# Altium project Smart_Assistant_H3.PrjPcb
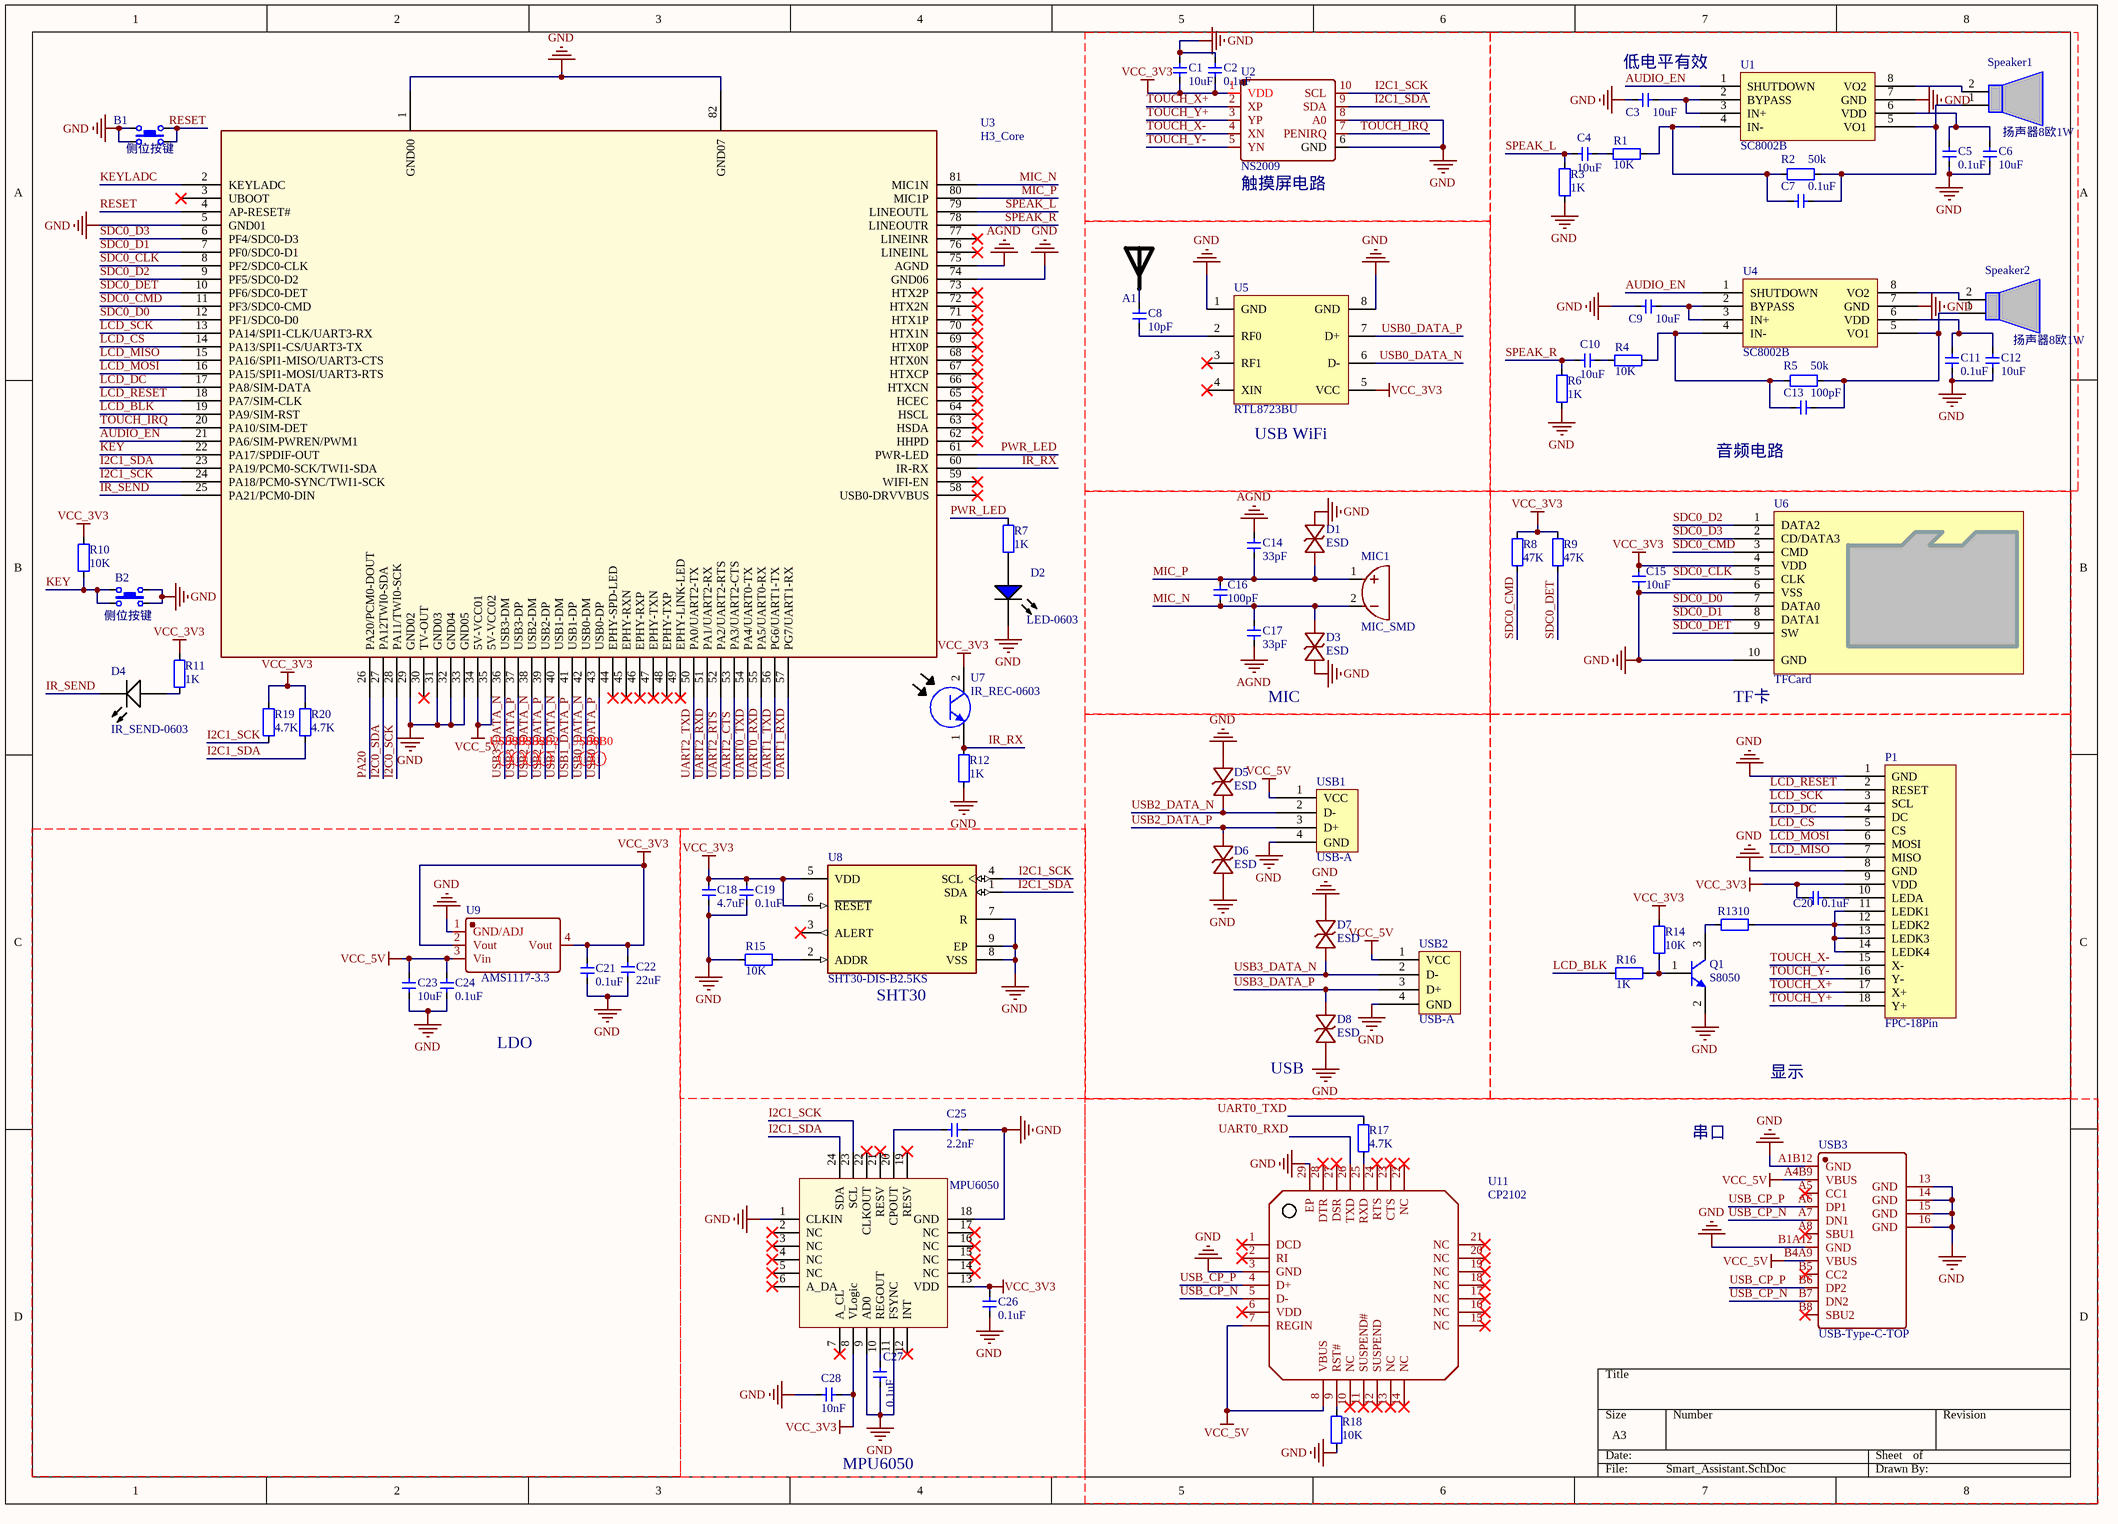
[diagram p0: Smart_Assistant.SchDoc]
1 sheet, 78 parts. Net scope: global (net labels, ports and power ports of the same name join across sheets).
Board file: Smart_Assistant.PcbDoc

## Sheet Smart_Assistant.SchDoc
size A3; SheetNumber: 1; SheetTotal: 1

### Parts
A1  RAINSUN  [ANT-Rainsun-AN5120]  (value not drawn)
B1  侧位按键  [侧位按键_3.5*3.55_90]
B2  侧位按键  [侧位按键_3.5*3.55_90]
C1  10uF  [电容0603]
C2  0.1uF  [电容0603]
C3  10uF  [电容0603]
C4  10uF  [电容0603]
C5  0.1uF  [电容0603]
C6  10uF  [电容0603]
C7  0.1uF  [电容0603]
C8  10pF  [电容0603]
C9  10uF  [电容0603]
C10  10uF  [电容0603]
C11  0.1uF  [电容0603]
C12  10uF  [电容0603]
C13  100pF  [电容0603]
C14  33pF  [电容0603]
C15  10uF  [电容0603]
C16  100pF  [电容0603]
C17  33pF  [电容0603]
C18  4.7uF  [电容0603]
C19  0.1uF  [电容0603]
C20  0.1uF  [电容0603]
C21  0.1uF  [电容0603]
C22  22uF  [电容0603]
C23  10uF  [电容0603]
C24  0.1uF  [电容0603]
C25  2.2nF  [电容0603]
C26  0.1uF  [电容0603]
C27  0.1uF  [电容0603]
C28  10nF  [电容0603]
D1  ESD  [ESD-0603]
D2  LED-0603  [LED-0603]
D3  ESD  [ESD-0603]
D4  IR_SEND-0603  [IR_SEND-0603]
D5  ESD  [ESD-0603]
D6  ESD  [ESD-0603]
D7  ESD  [ESD-0603]
D8  ESD  [ESD-0603]
MIC1  MIC_SMD  [MIC_SMD]
P1  FPC-18Pin  [FPC-0.5mm-18Pin]
Q1  S8050  [NPN-SOT-23]
R1  10K  [电阻0603]
R2  50k  [电阻0603]
R3  1K  [电阻0603]
R4  10K  [电阻0603]
R5  50k  [电阻0603]
R6  1K  [电阻0603]
R7  1K  [电阻0603]
R8  47K  [电阻0603]
R9  47K  [电阻0603]
R10  10K  [电阻0603]
R11  1K  [电阻0603]
R12  1K  [电阻0603]
R13  10  [电阻0603]
R14  10K  [电阻0603]
R15  10K  [电阻0603]
R16  1K  [电阻0603]
R17  4.7K  [电阻0603]
R18  10K  [电阻0603]
R19  4.7K  [电阻0603]
R20  4.7K  [电阻0603]
Speaker1  扬声器8欧1W  [扬声器 8欧1W]
Speaker2  扬声器8欧1W  [扬声器 8欧1W]
U1  SC8002B  [SC8002B-SOP-8]
U2  NS2009  [NS2009]
U3  H3_Core  [H3_Core]
U4  SC8002B  [SC8002B-SOP-8]
U5  RTL8723BU  [UBS_WiFi]
U6  TFCard  [TFCard]
U7  IR_REC-0603  [IR_REC-0603]
U8  SHT30-DIS-B2.5KS  [FP-SHT30-DIS-B2_5KS-MFG]
U9  AMS1117-3.3  [AMS1117-3.3]
U10  MPU6050  [QFN24-4*4]
U11  CP2102  [CP2102]
USB1  USB-A  [USB-A-TOP]
USB2  USB-A  [USB-A-TOP]
USB3  USB-Type-C-TOP  [Type-C-TOP]

### Nets
AGND: C14.2 C17.1 U3.75(AGND)
GND: B1.1 B1.3 B2.2 B2.4 C1.2 C2.2 C3.1 C5.1 C6.1 C9.1 C11.1 C12.1 C15.1 C18.1 C19.1 C21.1 C22.1 C23.1 C24.1 C25.2 C26.1 C27.1 C28.1 D1.2 D2.2(K) D3.1 D5.2 D6.1 D7.2 D8.1 P1.1(GND) P1.8(GND) Q1.2(E) R3.1 R6.1 R12.2 R15.1 R18.1 U1.7(GND) U2.6(GND) U2.8(A0) U3.1(GND00) U3.5(GND01) U3.29(GND02) U3.31(GND03) U3.32(GND04) U3.33(GND05) U3.74(GND06) U3.82(GND07) U4.7(GND) U5.1(GND) U5.8(GND) U6.6(VSS) U6.10(GND) U8.7(R) U8.8(VSS) U8.9(EP) U9.1(GND/ADJ) U10.1(CLKIN) U10.9(AD0) U10.11(FSYNC) U10.18(GND) U11.3(GND) U11.29(EP) USB1.4(GND) USB2.4(GND) USB3.13(GND) USB3.14(GND) USB3.15(GND) USB3.16(GND) USB3.A1B12(GND) USB3.B1A12(GND)
VCC_3V3: C1.1 C2.1 C15.2 C18.2 C19.2 C20.1 C21.2 C22.2 C26.2 C28.2 P1.9(VDD) R8.1 R9.1 R10.2 R11.2 R14.2 R19.2 R20.2 U2.1(VDD) U5.5(VCC) U6.4(VDD) U7.2(C) U8.5(VDD) U8.6(~{RESET}) U9.2(Vout) U9.4(Vout) U10.8(VLogic) U10.13(VDD)
VCC_5V: C23.2 C24.2 U3.34(5V-VCC01) U3.35(5V-VCC02) U9.3(Vin) U11.7(REGIN) U11.8(VBUS) USB1.1(VCC) USB2.1(VCC) USB3.A4B9(VBUS) USB3.B4A9(VBUS)
AUDIO_EN: U1.1(SHUTDOWN) U3.21(PA6/SIM-PWREN/PWM1) U4.1(SHUTDOWN)
I2C0_SCK: U3.28(PA11/TWI0-SCK)
I2C0_SDA: U3.27(PA12TWI0-SDA)
I2C1_SCK: R19.1 U2.10(SCL) U3.24(PA18/PCM0-SYNC/TWI1-SCK) U8.4(SCL) U10.23(SCL)
I2C1_SDA: R20.1 U2.9(SDA) U3.23(PA19/PCM0-SCK/TWI1-SDA) U8.1(SDA) U10.24(SDA)
IR_RX: R12.1 U3.60(IR-RX) U7.1(E)
IR_SEND: D4.2(K) U3.25(PA21/PCM0-DIN)
KEY: B2.1 B2.3 R10.1 U3.22(PA17/SPDIF-OUT)
KEYLADC: U3.2(KEYLADC)
LCD_BLK: R16.1 U3.19(PA9/SIM-RST)
LCD_CS: P1.5(CS) U3.14(PA13/SPI1-CS/UART3-TX)
LCD_DC: P1.4(DC) U3.17(PA8/SIM-DATA)
LCD_MISO: P1.7(MISO) U3.15(PA16/SPI1-MISO/UART3-CTS)
LCD_MOSI: P1.6(MOSI) U3.16(PA15/SPI1-MOSI/UART3-RTS)
LCD_RESET: P1.2(RESET) U3.18(PA7/SIM-CLK)
LCD_SCK: P1.3(SCL) U3.13(PA14/SPI1-CLK/UART3-RX)
MIC_N: C16.1 C17.2 D3.2 MIC1.2 U3.81(MIC1N)
MIC_P: C14.1 C16.2 D1.1 MIC1.1 U3.80(MIC1P)
PA20: U3.26(PA20/PCM0-DOUT)
PWR_LED: R7.1 U3.61(PWR-LED)
RESET: B1.2 B1.4 U3.4(AP-RESET#)
SDC0_CLK: U3.8(PF2/SDC0-CLK) U6.5(CLK)
SDC0_CMD: R8.2 U3.11(PF3/SDC0-CMD) U6.3(CMD)
SDC0_D0: U3.12(PF1/SDC0-D0) U6.7(DATA0)
SDC0_D1: U3.7(PF0/SDC0-D1) U6.8(DATA1)
SDC0_D2: U3.9(PF5/SDC0-D2) U6.1(DATA2)
SDC0_D3: U3.6(PF4/SDC0-D3) U6.2(CD/DATA3)
SDC0_DET: R9.2 U3.10(PF6/SDC0-DET) U6.9(SW)
SPEAK_L: C4.2 R3.2 U3.79(LINEOUTL)
SPEAK_R: C10.2 R6.2 U3.78(LINEOUTR)
TOUCH_IRQ: U2.7(PENIRQ) U3.20(PA10/SIM-DET)
TOUCH_X+: P1.17(X+) U2.2(XP)
TOUCH_X-: P1.15(X-) U2.4(XN)
TOUCH_Y+: P1.18(Y+) U2.3(YP)
TOUCH_Y-: P1.16(Y-) U2.5(YN)
UART0_RXD: U3.55(PA5/UART0-RX) U11.26(TXD)
UART0_TXD: R17.2 U3.54(PA4/UART0-TX)
UART1_RXD: U3.57(PG7/UART1-RX)
UART1_TXD: U3.56(PG6/UART1-TX)
UART2_CTS: U3.53(PA3/UART2-CTS)
UART2_RTS: U3.52(PA2/UART2-RTS)
UART2_RXD: U3.51(PA1/UART2-RX)
UART2_TXD: U3.50(PA0/UART2-TX)
USB0_DATA_N: U3.42(USB0-DM) U5.6(D-)
USB0_DATA_P: U3.43(USB0-DP) U5.7(D+)
USB1_DATA_N: U3.40(USB1-DM)
USB1_DATA_P: U3.41(USB1-DP)
USB2_DATA_N: D5.1 U3.38(USB2-DM) USB1.2(D-)
USB2_DATA_P: D6.2 U3.39(USB2-DP) USB1.3(D+)
USB3_DATA_N: D7.1 U3.36(USB3-DM) USB2.2(D-)
USB3_DATA_P: D8.2 U3.37(USB3-DP) USB2.3(D+)
USB_CP_N: U11.5(D-) USB3.A7(DN1) USB3.B7(DN2)
USB_CP_P: U11.4(D+) USB3.A6(DP1) USB3.B6(DP2)
NetA1_1: A1.1 C8.2
NetC3_2: C3.2 U1.2(BYPASS) U1.3(IN+)
NetC4_1: C4.1 R1.1
NetC5_2: C5.2 C6.2 U1.6(VDD)
NetC7_1: C7.1 R1.2 R2.1 U1.4(IN-)
NetC7_2: C7.2 R2.2 Speaker1.1 U1.5(VO1)
NetC8_1: C8.1 U5.2(RF0)
NetC9_2: C9.2 U4.2(BYPASS) U4.3(IN+)
NetC10_1: C10.1 R4.1
NetC11_2: C11.2 C12.2 U4.6(VDD)
NetC13_1: C13.1 R4.2 R5.1 U4.4(IN-)
NetC13_2: C13.2 R5.2 Speaker2.1 U4.5(VO1)
NetC20_2: C20.2 P1.10(LEDA)
NetC25_1: C25.1 U10.20(CPOUT)
NetC27_2: C27.2 U10.10(REGOUT)
NetD2_1: D2.1(A) R7.2
NetD4_1: D4.1(A) R11.1
NetP1_11: P1.11(LEDK1) P1.12(LEDK2) P1.13(LEDK3) P1.14(LEDK4) R13.2
NetQ1_1: Q1.1(B) R14.1 R16.2
NetQ1_3: Q1.3(C) R13.1
NetR15_2: R15.2 U8.2(ADDR)
NetR17_1: R17.1 U11.25(RXD)
NetR18_2: R18.2 U11.9(RST#)
NetSpeaker1_2: Speaker1.2 U1.8(VO2)
NetSpeaker2_2: Speaker2.2 U4.8(VO2)

Not connected (* = marked no-connect by the designer): U3 3(UBOOT)* 30(TV-OUT)* 44(EPHY-SPD-LED)* 45(EPHY-RXN)* 46(EPHY-RXP)* 47(EPHY-TXN)* 48(EPHY-TXP)* 49(EPHY-LINK-LED)* 58(USB0-DRVVBUS)* 59(WIFI-EN)* 62(HHPD)* 63(HSDA)* 64(HSCL)* 65(HCEC)* 66(HTXCN)* 67(HTXCP)* 68(HTX0N)* 69(HTX0P)* 70(HTX1N)* 71(HTX1P)* 72(HTX2N)* 73(HTX2P)* 76(LINEINL)* 77(LINEINR)*; U5 3(RF1)* 4(XIN)*; U8 3(ALERT)*; U10 2(NC)* 3(NC)* 4(NC)* 5(NC)* 6(A_DA)* 7(A_CL)* 12(INT)* 14(NC)* 15(NC)* 16(NC)* 17(NC)* 19(RESV)* 21(RESV)* 22(CLKOUT)*; U11 1(DCD)* 2(RI)* 6(VDD)* 10(NC)* 11(SUSPEND#)* 12(SUSPEND)* 13(NC)* 14(NC)* 15(NC)* 16(NC)* 17(NC)* 18(NC)* 19(NC)* 20(NC)* 21(NC)* 22(NC)* 23(CTS)* 24(RTS)* 27(DSR)* 28(DTR)*; USB3 A5(CC1)* A8(SBU1)* B5(CC2)* B8(SBU2)*

### Layout directives
differential pair: USB0_DATA_N, USB0_DATA_P, USB2_DATA_N, USB2_DATA_P, USB3_DATA_N, USB3_DATA_P

### Notes on the sheet
- (near C3) 低电平有效
- (near U2) 触摸屏电路
- (near U5) USB WiFi
- 音频电路
- MIC
- (near U6) TF卡
- LDO
- (near U8) SHT30
- (near D8) USB
- 显示
- 串口
- MPU6050

### Library data of the parts
A1 = ANT-Rainsun-AP5120: 陶瓷天线
C1-C28 = 电容-0603: Capacitor
D1 D3 D5-D8 = ESD-0603
D4 = IR_SEND-0603: 红外发射管
P1 = FPC-18Pin: 2.4寸LCD 中景园
Q1 = 贴片NPN三极管: High Voltage Transistor, NPN Silicon, 3-Pin SOT-23, Pb-Free, Tape and Reel; PartNumber: MMBTA42LT1G; Manufacturer: On Semiconductor; fT Min (MHz): 50; IC Continuous (A): 0.5; ComponentLink1URL: http://www.onsemi.com/; ComponentLink3URL: http://www.onsemi.cn/pub_link/Collateral/318-08.PDF; RoHS: TRUE; ComponentLink2Description: Datasheet; Polarity: NPN; DatasheetVersion: Rev. 12; PackageReference: SOT-23-3-318-08; PackageDescription: 3-Pin Small Outline Transistor, Body 2.92 x 1.3 mm, Pitch 0.95 mm; ComponentLink3Description: Package Specification; ComponentLink1Description: Manufacturer URL; Packing: Tape and Reel; PackageVersion: Rev. AP, 11/2009; Mounting Technology: Surface Mount; ComponentLink2URL: http://www.onsemi.cn/pub_link/Collateral/MMBTA42LT1-D.PDF; Manufacturer: ON Semiconductor; Manufacturer Part Number: MMBTA42LT1G
R1-R20 = 电阻-0603: Resistor
U1 U4 = SC8002B: 单声道4欧姆2.5W输出音频放大器
U3 = H3_Core: Allwinner_H3核心板 40.8mm*32mm 82pin
U5 = USB_WiFi
U7 = IR_REC-0603: 红外接收管
U8 = SHT30: SHT30 I2C地址为0x44; Manufacturer: Sensirion; Manufacturer Part Number: SHT30-DIS-B2.5KS
U9 = AMS1117-3.3 SOT-23: 5V-3.3V 1A
U10 = MPU6050: 六轴传感器